# EAGLE design board (EAGLE 9.6.2)
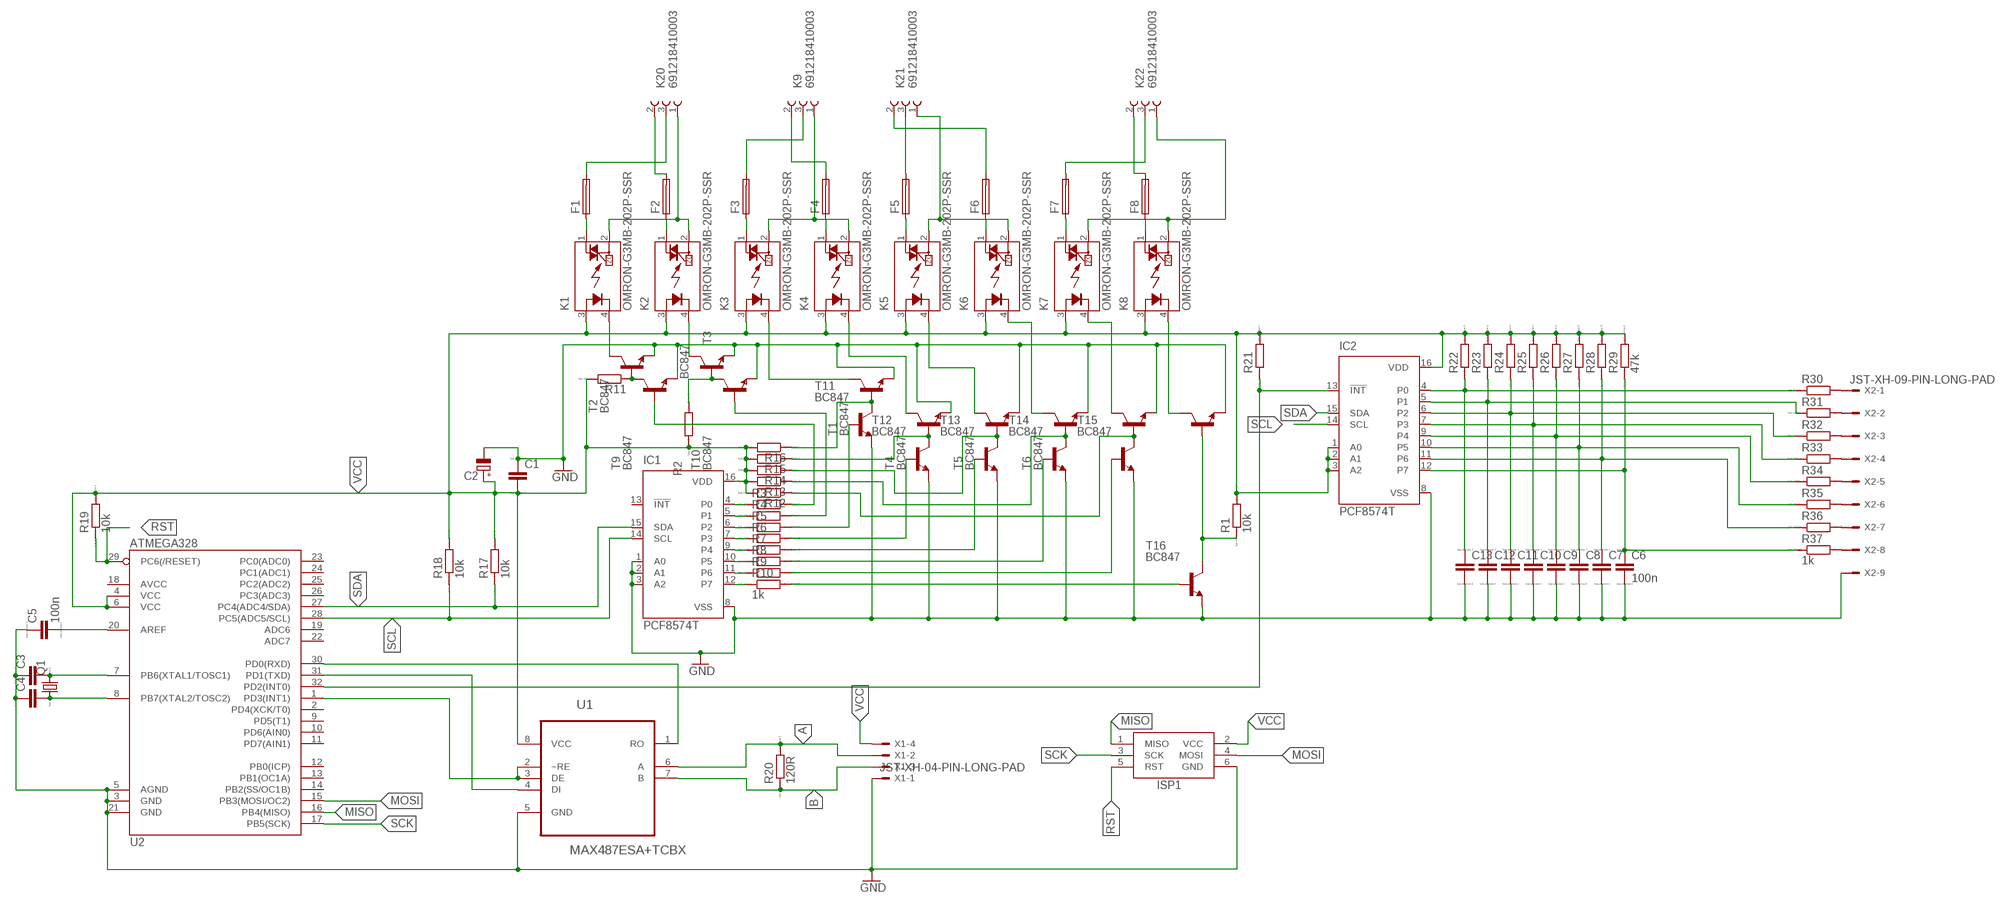
[diagram p0: schematic, sheet 1]

## Parts
C1  CC1206  [C1206]
C2  CPOL-EU150CLZ-0810  [150CLZ-0810]
C3  C  [C0805]
C4  C  [C0805]
C5  100n  C  [C0805]
C6  100n  C  [C0805]
C7  C  [C0805]
C8  C  [C0805]
C9  C  [C0805]
C10  C  [C0805]
C11  C  [C0805]
C12  C  [C0805]
C13  C  [C0805]
F1  FUSELITTLEFUSE  [LITTLEFUSE]
F2  FUSELITTLEFUSE  [LITTLEFUSE]
F3  FUSELITTLEFUSE  [LITTLEFUSE]
F4  FUSELITTLEFUSE  [LITTLEFUSE]
F5  FUSELITTLEFUSE  [LITTLEFUSE]
F6  FUSELITTLEFUSE  [LITTLEFUSE]
F7  FUSELITTLEFUSE  [LITTLEFUSE]
F8  FUSELITTLEFUSE  [LITTLEFUSE]
IC1  PCF8574T  [SO16W]
IC2  PCF8574T  [SO16W]
ISP1  AVRISP-6  [AVRISP]
K1  OMRON-G3MB-202P-SSR  [OMRON-G3MB-202P-SSR]
K2  OMRON-G3MB-202P-SSR  [OMRON-G3MB-202P-SSR]
K3  OMRON-G3MB-202P-SSR  [OMRON-G3MB-202P-SSR]
K4  OMRON-G3MB-202P-SSR  [OMRON-G3MB-202P-SSR]
K5  OMRON-G3MB-202P-SSR  [OMRON-G3MB-202P-SSR]
K6  OMRON-G3MB-202P-SSR  [OMRON-G3MB-202P-SSR]
K7  OMRON-G3MB-202P-SSR  [OMRON-G3MB-202P-SSR]
K8  OMRON-G3MB-202P-SSR  [OMRON-G3MB-202P-SSR]
K9  691218410003  [691218410003]
K20  691218410003  [691218410003]
K21  691218410003  [691218410003]
K22  691218410003  [691218410003]
Q1  CRYSTALHC49S  [HC49/S]
R1  10k  RR1206  [R1206]
R2  RR1206  [R1206]
R3  RR1206  [R1206]
R4  RR1206  [R1206]
R5  RR1206  [R1206]
R6  RR1206  [R1206]
R7  RR1206  [R1206]
R8  RR1206  [R1206]
R9  RR1206  [R1206]
R10  1k  RR1206  [R1206]
R11  RR1206  [R1206]
R12  RR1206  [R1206]
R13  RR1206  [R1206]
R14  RR1206  [R1206]
R15  RR1206  [R1206]
R16  RR1206  [R1206]
R17  10k  RR1206  [R1206]
R18  10k  RR1206  [R1206]
R19  10k  RR1206  [R1206]
R20  120R  RR1206  [R1206]
R21  RR1206  [R1206]
R22  RR1206  [R1206]
R23  RR1206  [R1206]
R24  RR1206  [R1206]
R25  RR1206  [R1206]
R26  RR1206  [R1206]
R27  RR1206  [R1206]
R28  RR1206  [R1206]
R29  47k  RR1206  [R1206]
R30  RR1206  [R1206]
R31  RR1206  [R1206]
R32  RR1206  [R1206]
R33  RR1206  [R1206]
R34  RR1206  [R1206]
R35  RR1206  [R1206]
R36  RR1206  [R1206]
R37  1k  RR1206  [R1206]
T1  BC847  [SOT23]
T2  BC847  [SOT23]
T3  BC847  [SOT23]
T4  BC847  [SOT23]
T5  BC847  [SOT23]
T6  BC847  [SOT23]
T7  BC847  [SOT23]
T8  BC847  [SOT23]
T9  BC847  [SOT23]
T10  BC847  [SOT23]
T11  BC847  [SOT23]
T12  BC847  [SOT23]
T13  BC847  [SOT23]
T14  BC847  [SOT23]
T15  BC847  [SOT23]
T16  BC847  [SOT23]
U1  MAX487ESA+TCBX  [SOIC127P600X175-8N]
U2  ATMEGA328  [TQFP32-08]
X1  JST-XH-04-PIN-LONG-PAD  [JST-XH-04-PACKAGE-LONG-PAD]
X2  JST-XH-09-PIN-LONG-PAD  [JST-XH-09-PACKAGE-LONG-PAD]

## Nets
A: R20.2 U1.6(A) X1.2
B: R20.1 U1.7(B) X1.3
GND: C1.1 C2.- C3.1 C4.1 C5.1 C6.2 C7.2 C8.2 C9.2 C10.2 C11.2 C12.2 C13.2 IC1.1(A0) IC1.2(A1) IC1.3(A2) IC1.8(VSS) IC2.8(VSS) ISP1.6(GND) T1.2(E) T2.2(E) T3.2(E) T4.2(E) T5.2(E) T6.2(E) T7.2(E) T8.2(E) T9.2(E) T10.2(E) T11.2(E) T12.2(E) T13.2(E) T14.2(E) T15.2(E) T16.2(E) U1.5(GND) U2.3(GND) U2.5(AGND) U2.21(GND) X1.1 X2.9
MISO: ISP1.1(MISO) U2.16(PB4(MISO))
MOSI: ISP1.4(MOSI) U2.15(PB3(MOSI/OC2))
N$1: C13.1 IC2.4(P0) R22.1 R30.1
N$3: IC1.4(P0) R3.1
N$4: IC1.5(P1) R4.1
N$5: R1.1 T8.1(B) T16.3(C)
N$6: IC1.6(P2) R5.1
N$7: IC1.7(P3) R6.1
N$8: IC1.9(P4) R7.1
N$9: IC1.10(P5) R8.1
N$10: IC1.11(P6) R9.1
N$11: IC1.12(P7) R10.1
N$12: U1.2(~RE) U1.3(DE) U2.1(PD3(INT1))
N$13: K7.4(K) T7.3(C)
N$14: C3.2 Q1.2 U2.7(PB6(XTAL1/TOSC1))
N$15: C12.1 IC2.5(P1) R23.1 R31.1
N$16: C11.1 IC2.6(P2) R24.1 R32.1
N$17: C4.2 Q1.1 U2.8(PB7(XTAL2/TOSC2))
N$18: R10.2 T16.1(B)
N$19: C10.1 IC2.7(P3) R25.1 R33.1
N$20: K1.2(DS2) K2.2(DS2) K20.1
N$21: C9.1 IC2.9(P4) R26.1 R34.1
N$22: C8.1 IC2.10(P5) R27.1 R35.1
N$23: C7.1 IC2.11(P6) R28.1 R36.1
N$24: C6.1 IC2.12(P7) R29.1 R37.1
N$25: R30.2 X2.1
N$26: IC2.13(!INT) R21.1 U2.32(PD2(INT0))
N$27: R31.2 X2.2
N$28: R32.2 X2.3
N$29: R33.2 X2.4
N$30: R34.2 X2.5
N$31: F1.1 K1.1(DS1)
N$32: F2.1 K2.1(DS1)
N$33: R35.2 X2.6
N$34: F3.1 K3.1(DS1)
N$35: F4.1 K4.1(DS1)
N$36: R36.2 X2.7
N$37: F5.1 K5.1(DS1)
N$38: K7.2(DS2) K8.2(DS2) K22.1
N$39: F8.2 K22.2
N$40: F7.2 K22.3
N$41: F6.2 K21.2
N$42: F5.2 K21.3
N$43: F4.2 K9.2
N$44: F3.2 K9.3
N$45: F6.1 K6.1(DS1)
N$46: F1.2 K20.3
N$47: F7.1 K7.1(DS1)
N$48: F8.1 K8.1(DS1)
N$49: R37.2 X2.8
N$50: F2.2 K20.2
N$51: R12.1 T7.1(B) T15.3(C)
N$52: R14.1 T5.1(B) T13.3(C)
N$53: C5.2 U2.20(AREF)
N$54: K3.2(DS2) K4.2(DS2) K9.1
N$55: K5.2(DS2) K6.2(DS2) K21.1
N$56: R13.1 T6.1(B) T14.3(C)
N$57: U1.1(RO) U2.30(PD0(RXD))
N$58: U1.4(DI) U2.31(PD1(TXD))
N$59: R11.1 T2.1(B) T9.3(C)
N$60: K1.4(K) T2.3(C)
N$61: R2.2 T3.1(B) T10.3(C)
N$62: K2.4(K) T3.3(C)
N$63: R3.2 T9.1(B)
N$64: R4.2 T10.1(B)
N$65: R16.1 T1.1(B) T11.3(C)
N$66: R15.1 T4.1(B) T12.3(C)
N$67: R5.2 T11.1(B)
N$68: R6.2 T12.1(B)
N$69: K8.4(K) T8.3(C)
N$70: R7.2 T13.1(B)
N$71: K6.4(K) T6.3(C)
N$72: K5.4(K) T5.3(C)
N$73: R8.2 T14.1(B)
N$74: K4.4(K) T4.3(C)
N$75: R9.2 T15.1(B)
N$76: K3.4(K) T1.3(C)
RST: ISP1.5(RST) R19.1 U2.29(PC6(/RESET))
SCK: ISP1.3(SCK) U2.17(PB5(SCK))
SCL: IC1.14(SCL) IC2.14(SCL) R18.1 U2.28(PC5(ADC5/SCL))
SDA: IC1.15(SDA) IC2.15(SDA) R17.1 U2.27(PC4(ADC4/SDA))
VCC: C1.2 C2.+ IC1.16(VDD) IC2.1(A0) IC2.2(A1) IC2.3(A2) IC2.16(VDD) ISP1.2(VCC) K1.3(A) K2.3(A) K3.3(A) K4.3(A) K5.3(A) K6.3(A) K7.3(A) K8.3(A) R1.2 R2.1 R11.2 R12.2 R13.2 R14.2 R15.2 R16.2 R17.2 R18.2 R19.2 R21.2 R22.2 R23.2 R24.2 R25.2 R26.2 R27.2 R28.2 R29.2 U1.8(VCC) U2.4(VCC) U2.6(VCC) X1.4
Unconnected: IC1.13(!INT) U2.2(PD4(XCK/T0)) U2.9(PD5(T1)) U2.10(PD6(AIN0)) U2.11(PD7(AIN1)) U2.12(PB0(ICP)) U2.13(PB1(OC1A)) U2.14(PB2(SS/OC1B)) U2.18(AVCC) U2.19(ADC6) U2.22(ADC7) U2.23(PC0(ADC0)) U2.24(PC1(ADC1)) U2.25(PC2(ADC2)) U2.26(PC3(ADC3))

## Library data of the parts
C1 C3-C13 = eagle-ltspice:C: CAPACITOR, European symbol; SPICEMODEL: NONE; SPICEPREFIX: C
C2 = rcl:CPOL-EU: POLARIZED CAPACITOR, European symbol; SPICEPREFIX: C
F1-F8 = fuse:FUSE: Fuse; OC_FARNELL: unknown; OC_NEWARK: unknown
IC1 IC2 = micro-philips:PCF8574: I2C-Bus Remote 8-bit I/O expander http://www.semiconductors.philips.com/acrobat_download/datasheets/PCF8574_4.pdf; MPN: PCF8574T/3,512; OC_FARNELL: 1201255; OC_NEWARK: 70R6870
ISP1 = adafruit:AVRISP: AVR ISP HEADER Standard 6 pin header for AVR programming
K1-K8 = Omron G3MB 202p SSR:OMRON-G3MB-202P-SSR: IT(rms) 8A, Zero Cross type SIP 4pin Triac output SSR Source: http://sharp-world.com/products/device/lineup/data/pdf/datasheet/s102s02_e.pdf
K9 K20-K22 = Wurth_Elektronik_Electromechanic_Terminal_Blocks_Connectors_rev15c:691218410003: WR-TBL Serie 2184 - 7.62mm Horizontal Entry Modular with Rising Cage Clamp - 5.3mm2 Wires, 3 Pins=>Code : Con_TBL_Screw_RisingClamp_7.62_691218410003 <http://katalog.we-online.de/media/images/eican/Con_TBL_Screw_RisingClamp_7.62_6912184100xx_pf2.jpg> Details see: http://katalog.we-online.de/en/em/691_218_410_0xx Created 2014-06-18, Karrer Zheng 2014 (C) Würth Elektronik
Q1 = crystal:CRYSTAL: CRYSTAL; OC_FARNELL: 1667008; OC_NEWARK: unknown
R1-R37 = eagle-ltspice:R: RESISTOR, European symbol; SPICEMODEL: NONE; SPICEPREFIX: R
T1-T8 = transistor:BC847: NPN TRANSISTOR
T9-T16 = nxp_60:BC847: 45 V, 100 mA NPN general-purpose transistors NPN general-purpose transistor AAL Eindhoven MK
U1 = MAX487ESA_TCBX:MAX487ESA+TCBX: Low-Power, Slew-Rate-Limited RS-485/RS-422 Transceivers Check prices <https://pricing.snapeda.com/parts/MAX487ESA%2BTCBX/Maxim%20Integrated/view-part?ref=eda>; AVAILABILITY: Warning; DESCRIPTION: 1/1 Transceiver Half RS422, RS485 8-SOIC; MF: Maxim Integrated; MP: MAX487ESA+TCBX; PACKAGE: SOIC-8 Maxim Integrated; PRICE: None; PURCHASE-URL: https://pricing.snapeda.com/search/part/MAX487ESA+TCBX/?ref=eda
U2 = thecustomgeek:ATMEGA328: ATmega328P-AU TQFP 32 pin
X1 = Rembrandt Electronics - JST XH Connectors v1-0:JST-XH-04-PIN: JST XH Connector 2 Pin Wire to board connector. Pitch: 2,54 mm, (0.100") Number of pins: 4 Created by Rembrandt Electronics www.rembrandtelectronics.com
X2 = Rembrandt Electronics - JST XH Connectors v1-0:JST-XH-09-PIN: JST XH Connector 2 Pin Wire to board connector. Pitch: 2,54 mm, (0.100") Number of pins: 9 Created by Rembrandt Electronics www.rembrandtelectronics.com

## Board
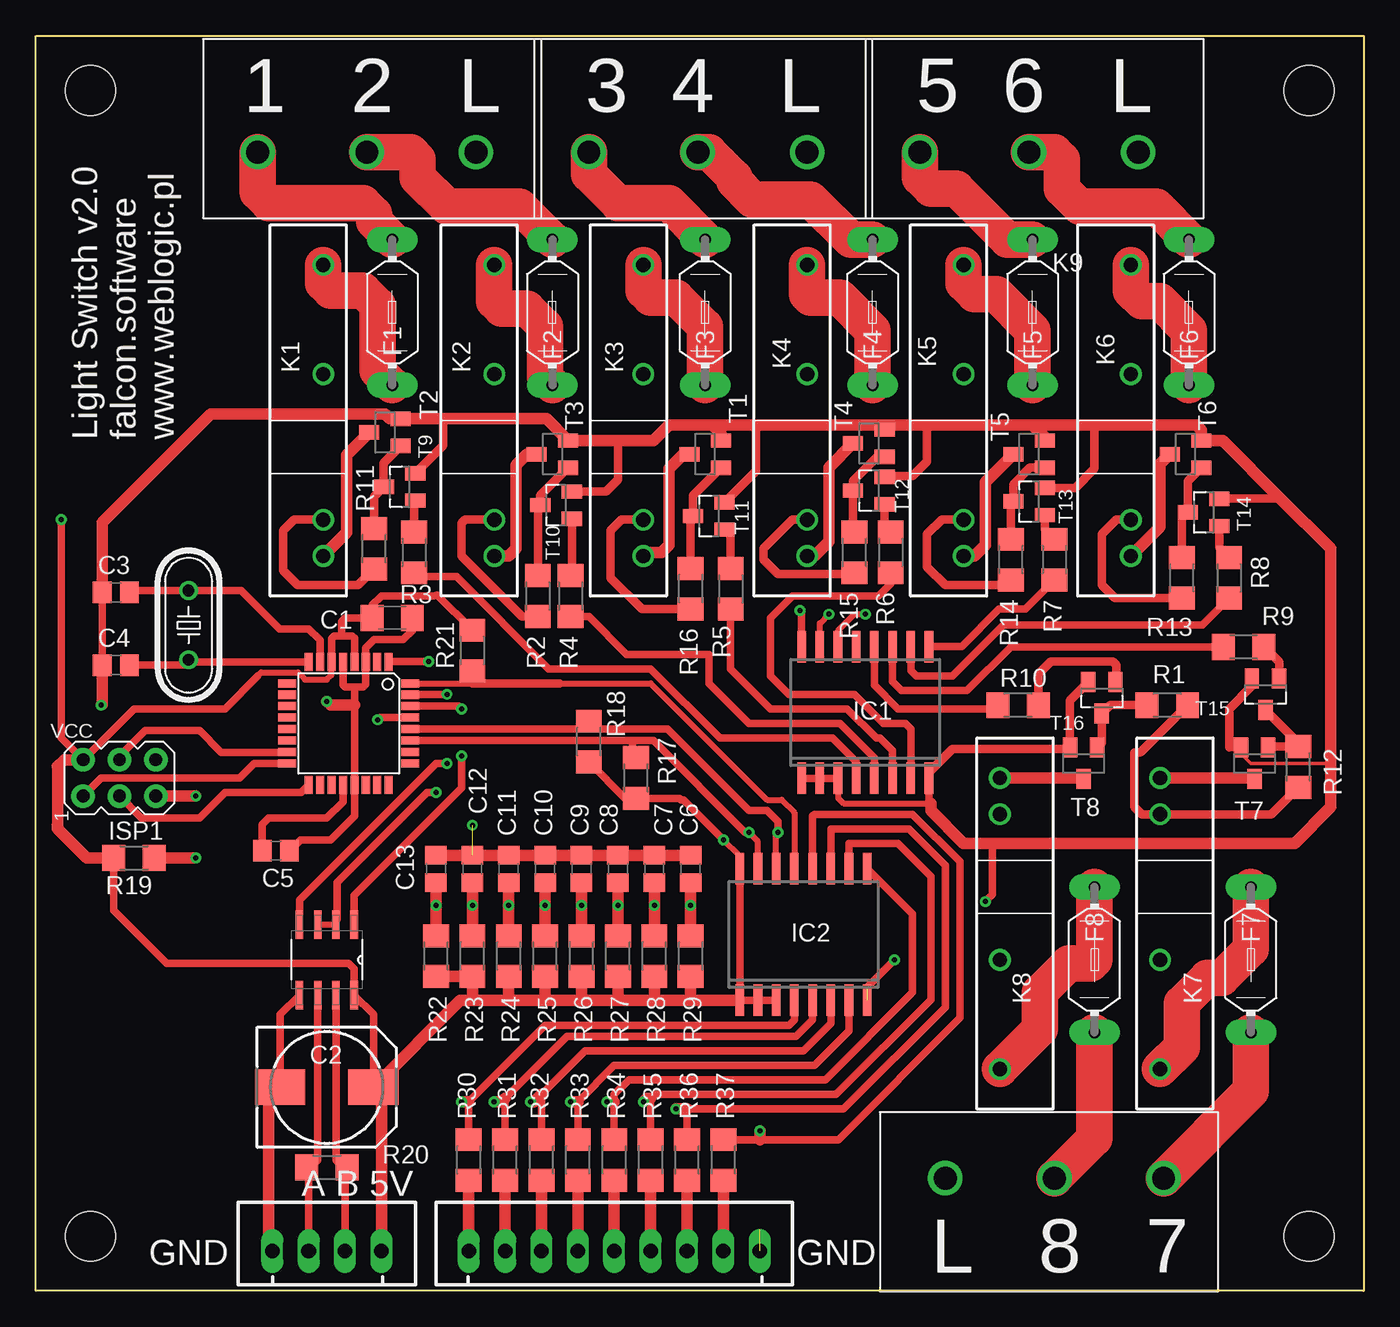
[diagram p1: board, top side]
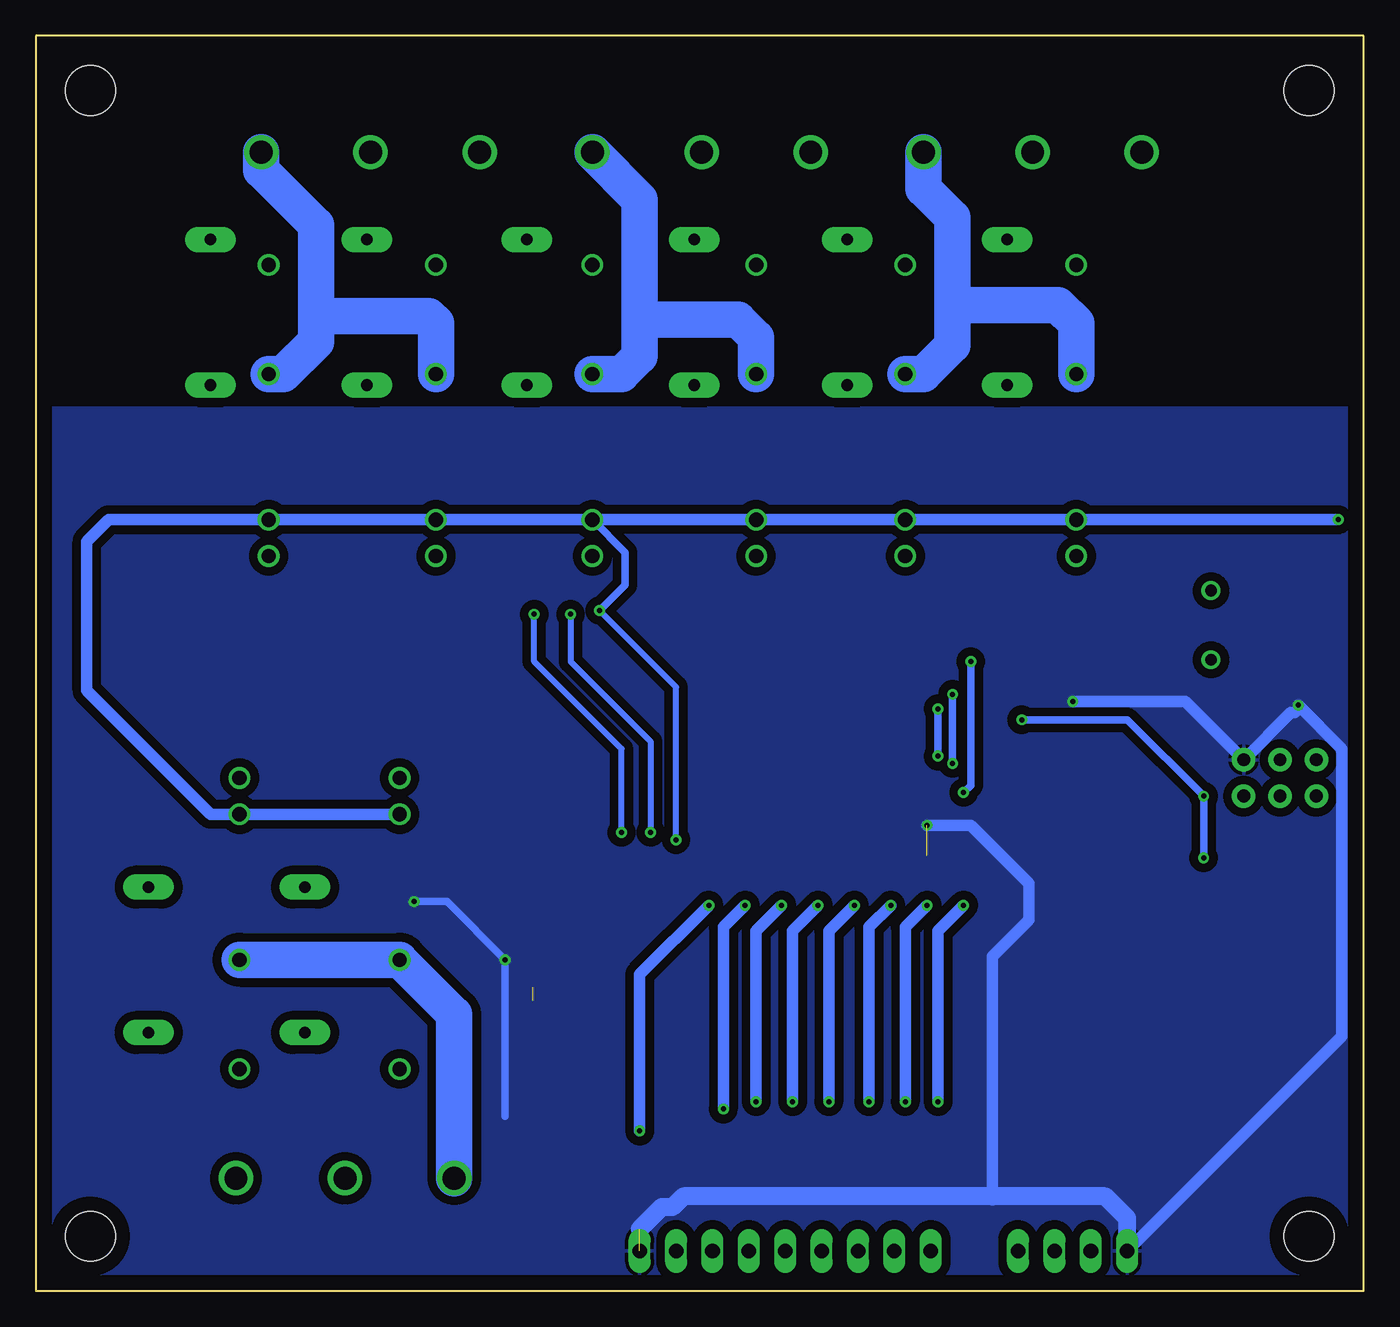
[diagram p2: board, bottom side, seen from below]

Size 92.71 x 87.63 mm. Coordinates in mm from the lower left corner, seen from the top.
Outline: 0,0 0,87.63 92.71,87.63 92.71,0 0,0
Copper layers (1*16): Top 0.035mm / dielectric 1.5mm / Bottom 0.035mm
Design rules "default": minimum track width 6mil, minimum drill 0.35mm, track to track 6mil, track to pad 6mil, pad to pad 6mil, via to via 6mil, smd to smd 6mil, copper to edge 40mil, drill to drill 6mil, minimum pad ring 10mil, minimum via ring 8mil, stop-mask expansion 4mil, vias tented up to drill 0mil, thermal gap 10mil
Holes 3.48 mm at 3.81,83.82 88.9,83.82 88.9,3.81 3.81,3.81

### Footprints (pad centres in the part's own frame; a part is rotated, then mirrored left to right if it is on the bottom)
C1206 = smd 1.6 x 1.8: 1 -1.4,0; 2 1.4,0
150CLZ-0810 = smd 3.5 x 2.5: + 3.25,0; - -3.25,0
C0805 = smd 1.3 x 1.5: 1 -0.95,0; 2 0.95,0
LITTLEFUSE = drill 0.813 pad 1.778 long: 1 -5.08,0; 2 5.08,0
SO16W = smd 0.6 x 2.2: 1 -4.445,-4.6; 2 -3.175,-4.6; 3 -1.905,-4.6; 4 -0.635,-4.6; 5 0.635,-4.6; 6 1.905,-4.6; 7 3.175,-4.6; 8 4.445,-4.6; 9 4.445,4.6; 10 3.175,4.6; 11 1.905,4.6; 12 0.635,4.6; 13 -0.635,4.6; 14 -1.905,4.6; 15 -3.175,4.6; 16 -4.445,4.6
AVRISP = drill 0.9 pad 1.626: 1 -1.27,2.54; 2 1.27,2.54; 3 -1.27,0; 4 1.27,0; 5 -1.27,-2.54; 6 1.27,-2.54
OMRON-G3MB-202P-SSR = drill 1: 1 -12.7,0; 2 -5.08,0; 3 5.08,0; 4 7.62,0
691218410003 = drill 1.6: 1 -7.62,0; 2 0,0; 3 7.62,0
HC49/S = drill 0.813: 1 -2.413,0; 2 2.413,0
R1206 = smd 1.6 x 1.803: 1 -1.422,0; 2 1.422,0
SOT23 = smd 1 x 1.4: 1 -0.95,-1.1; 2 0.95,-1.1; 3 0,1.1
SOIC127P600X175-8N = smd 1.981 x 0.533: 1 -2.464,1.905; 2 -2.464,0.635; 3 -2.464,-0.635; 4 -2.464,-1.905; 5 2.464,-1.905; 6 2.464,-0.635; 7 2.464,0.635; 8 2.464,1.905
TQFP32-08 = smd 1.27 x 0.559: 1 -4.293,2.8; 2 -4.293,2; 3 -4.293,1.2; 4 -4.293,0.4; 5 -4.293,-0.4; 6 -4.293,-1.2; 7 -4.293,-2; 8 -4.293,-2.8; 17 4.293,-2.8; 18 4.293,-2; 19 4.293,-1.2; 20 4.293,-0.4; 21 4.293,0.4; 22 4.293,1.2; 23 4.293,2; 24 4.293,2.8 | smd 0.559 x 1.27: 9 -2.8,-4.293; 10 -2,-4.293; 11 -1.2,-4.293; 12 -0.4,-4.293; 13 0.4,-4.293; 14 1.2,-4.293; 15 2,-4.293; 16 2.8,-4.293; 25 2.8,4.293; 26 2,4.293; 27 1.2,4.293; 28 0.4,4.293; 29 -0.4,4.293; 30 -1.2,4.293; 31 -2,4.293; 32 -2.8,4.293
JST-XH-04-PACKAGE-LONG-PAD = drill 1.016 long: 1 -3.81,0; 2 -1.27,0; 3 1.27,0; 4 3.81,0
JST-XH-09-PACKAGE-LONG-PAD = drill 1.016 long: 1 -10.16,0; 2 -7.62,0; 3 -5.08,0; 4 -2.54,0; 5 0,0; 6 2.54,0; 7 5.08,0; 8 7.62,0; 9 10.16,0

### Placement (x,y rotation side)
C1  24.89,46.99 180 top
C2  20.32,14.22 0 top
C3  5.59,48.77 0 top
C4  5.59,43.69 0 top
C5  16.76,30.73 180 top
C6  45.72,29.46 90 top
C7  43.18,29.46 90 top
C8  40.64,29.46 90 top
C9  38.1,29.46 90 top
C10  35.56,29.46 90 top
C11  33.02,29.46 90 top
C12  30.48,29.46 90 top
C13  27.94,29.46 90 top
F1  24.89,68.33 90 top
F2  36.07,68.33 90 top
F3  46.74,68.33 90 top
F4  58.42,68.33 90 top
F5  69.6,68.33 90 top
F6  80.52,68.33 90 top
F7  84.84,23.11 270 top
F8  73.91,23.11 270 top
IC1  57.91,40.39 0 top
IC2  53.59,24.89 0 top
ISP1  5.84,35.81 90 top
K1  20.07,58.93 270 top
K2  32,58.93 270 top
K3  42.42,58.93 270 top
K4  53.85,58.93 270 top
K5  64.77,58.93 270 top
K6  76.45,58.93 270 top
K7  78.49,28.19 90 top
K8  67.31,28.19 90 top
K9  46.23,79.5 180 top
K20  23.11,79.5 180 top
K21  69.34,79.5 180 top
K22  71.12,7.87 0 top
Q1  10.67,46.48 90 top
R1  78.99,40.89 0 top
R2  35.05,48.51 90 top
R3  26.42,51.56 90 top
R4  37.34,48.51 90 top
R5  48.51,49.02 90 top
R6  59.69,51.56 90 top
R7  71.12,51.05 90 top
R8  83.31,49.78 90 top
R9  84.33,44.96 0 top
R10  68.58,40.89 0 top
R11  23.62,51.82 270 top
R12  88.14,36.58 270 top
R13  80.01,49.78 270 top
R14  68.07,51.05 270 top
R15  57.15,51.56 270 top
R16  45.72,49.02 270 top
R17  41.91,35.81 270 top
R18  38.61,38.35 270 top
R19  6.86,30.23 180 top
R20  20.32,8.64 180 top
R21  30.48,44.7 90 top
R22  27.94,23.37 270 top
R23  30.48,23.37 270 top
R24  33.02,23.37 270 top
R25  35.56,23.37 270 top
R26  38.1,23.37 270 top
R27  40.64,23.37 270 top
R28  43.18,23.37 270 top
R29  45.72,23.37 270 top
R30  30.23,9.14 270 top
R31  32.77,9.14 270 top
R32  35.31,9.14 270 top
R33  37.85,9.14 270 top
R34  40.39,9.14 270 top
R35  42.93,9.14 270 top
R36  45.47,9.14 270 top
R37  48.01,9.14 270 top
T1  46.74,58.42 90 top
T2  24.38,59.94 90 top
T3  36.07,58.42 90 top
T4  58.17,59.18 90 top
T5  69.34,58.42 90 top
T6  80.26,58.42 90 top
T7  85.09,36.83 180 top
T8  73.15,36.83 180 top
T9  25.4,56.13 90 top
T10  36.32,54.86 90 top
T11  46.99,54.1 90 top
T12  58.17,55.88 90 top
T13  69.34,55.12 90 top
T14  81.53,54.36 90 top
T15  85.85,41.66 180 top
T16  74.42,41.4 180 top
U1  20.32,23.11 270 top
U2  21.84,39.62 270 top
X1  20.32,2.79 0 top
X2  40.39,2.79 0 top

### Tracks (layer width: path | path; a pad name or v marks a point on that pad's centre or on a via)
A
  Top 0.508: X1.2 19.05,8.48 | 19.05,8.48 R20.2 | U1.6 19.68,9.12 19.05,8.48
B
  Top 0.508: X1.3 21.59,8.48 | 21.59,8.48 R20.1 | U1.7 20.95,9.12 21.59,8.48
GND  (via drill 0.35)  (3 unrouted)
  Top 0.254: 90.42,36.83 84.84,36.83 84.14,37.53 T7.2
  Top 0.406: IC1.3 56.01,34.42 56.39,34.04 62.36,34.04
  Top 0.508: 62.48,33.53 62.36,33.66 62.36,34.04 IC1.8 | IC1.1 IC1.2 IC1.3 | 58.04,21.21 v59.94,23.11 | 66.8,31.24 66.8,27.69 v66.29,27.18 | C2.- 17.07,19.3 U1.5 | U2.5 21.44,42.31 21.59,42.16 22.1,42.16 | 22.1,42.16 22.86,42.16 23.04,42.35 U2.3 23.04,44.89 23.62,45.47 25.65,45.47 26.29,46.1 C1.1 | 22.1,42.16 22.24,42.02 22.24,40.89 U2.21 22.24,33.17 20.57,31.5 18.48,31.5 C5.1 | C3.1 4.64,48.51 C4.1 | T7.2 83.31,37.93
  Top 0.61: T9.2 28.45,59.03 28.45,60.89 | T10.2 39.81,55.81 40.64,56.64 40.64,59.37 | T11.2 50.29,57.25 50.29,60.45 | T12.2 59.33,56.9 61.21,56.9 62.23,57.91 62.23,60.45 | T13.2 72.58,56.07 73.91,57.4 73.91,60.45 | T14.2 86.8,55.31 86.87,55.37 | T15.2 84.9,42.23 83.31,40.64 83.31,37.93 | T16.2 72.2,41.23 T8.2 72.12,37.85 64.01,37.85 62.36,36.2 IC1.8
  Top 0.813: 47.24,60.45 44.2,60.45 43.11,59.37 40.64,59.37 T3.2 35.64,60.89 28.45,60.89 T2.2 24.7,60.89 24.38,61.21 12.19,61.21 4.64,53.66 4.64,48.51 | T1.2 47.84,59.86 47.24,60.45 | 47.24,60.45 50.29,60.45 58.67,60.45 | 58.67,60.45 58.99,60.13 T4.2 | 58.67,60.45 62.23,60.45 69.6,60.45 | T5.2 70.44,59.61 69.6,60.45 | 69.6,60.45 73.91,60.45 81.03,60.45 81.36,60.11 T6.2 82.87,59.37 86.87,55.37 90.42,51.82 90.42,36.83 90.42,33.78 87.88,31.24 66.8,31.24 64.77,31.24 62.48,33.53 62.48,34.04 | X1.1 16.26,3.05 16.26,13.41 C2.- | C4.1 4.64,40.96 v4.57,40.89 | 22.24,40.89 20.57,40.89 v20.32,41.15 | C6.2 C7.2 C8.2 C9.2 C10.2 C11.2 C12.2 C13.2
  Bottom 0.508: v66.29,27.18 64.01,27.18 v59.94,23.11 59.94,12.19
  Bottom 0.813: X1.1 1.52,17.78 1.52,37.85 v4.57,40.89 4.57,40.64 4.83,40.39 5.08,40.39 ISP1.6 12.45,41.15 v20.32,41.15 | 25.91,6.6 25.91,23.37 23.37,25.91 23.37,28.45 27.43,32.51 v30.48,32.51
  Bottom 1.27: X1.1 16.51,5.08 18.03,6.6 25.91,6.6 47.5,6.6 48.26,5.84 49.02,5.84 50.55,4.32
  pour Bottom (isolate 0.61): 1.02,61.72 92.2,61.72 92.2,1.52 91.69,1.02 1.02,1.02
MISO
  Top 0.508: ISP1.1 4.57,35.81 14.22,35.81 15.23,36.82 U2.16
MOSI
  Top 0.508: ISP1.4 5.84,37.34 7.62,39.12 11.43,39.12 12.95,37.59 17.52,37.59 U2.15
N$1  (via drill 0.35)
  Top 0.508: IC2.4 52.96,18.92 52.58,18.54 35.56,18.54 30.23,13.21 R30.1
  Top 0.813: 30.23,13.21 v29.72,13.21 | R22.1 v27.94,26.92 C13.1
  Bottom 0.813: v27.94,26.92 29.72,25.15 v29.72,13.21
N$3
  Top 0.508: IC1.4 57.28,36.96 55.63,38.61 47.75,38.61 42.93,43.43 35.81,43.43 29.36,49.89 26.67,49.89 R3.1
N$4
  Top 0.508: R4.1 38.61,47.09 41.25,44.45 46.99,44.45 46.99,42.42 49.78,39.62 56.13,39.62 58.55,37.21 IC1.5
N$5
  Top 0.61: T8.1 74.42,38.25 T16.3 75.01,40.89 R1.1
N$6
  Top 0.508: IC1.6 59.82,37.72 58.93,38.61 58.67,38.61 56.64,40.64 51.31,40.64 48.51,43.43 R5.1
N$7
  Top 0.508: IC1.7 61.09,39.24 60.71,39.62 59.18,39.62 57.15,41.66 52.58,41.66 51.31,42.93 51.31,46.99 52.83,48.51 58.83,48.51 59.69,49.38 R6.1
N$8
  Top 0.508: IC1.9 64.64,44.99 67.26,47.6 69.09,47.6 R7.1
N$9
  Top 0.508: IC1.10 61.09,43.31 61.47,42.93 64.01,42.93 67.56,46.48 81.43,46.48 R8.1
N$10
  Top 0.508: IC1.11 59.82,42.55 60.45,41.91 65.02,41.91 68.07,44.96 R9.1
N$11
  Top 0.508: IC1.12 58.55,42.29 60.2,40.64 66.9,40.64 R10.1
N$12  (via drill 0.35)
  Top 0.406: U1.3 U1.2
  Top 0.508: U1.2 20.95,25.83 21.04,25.92 21.04,28.52 27.33,34.8 v27.94,34.8 | U2.1 24.67,43.94 v27.43,43.94
  Bottom 0.508: v27.43,43.94 27.43,35.31 v27.94,34.8
N$13
  Top 0.813: K7.4 85.01,35.81 T7.3
N$14
  Top 0.508: U2.7 19.84,45.43 19.05,46.23 17.02,46.23 14.35,48.9 Q1.2 6.67,48.9 C3.2
N$15  (via drill 0.35)
  Top 0.508: IC2.5 54.23,18.92 53.09,17.78 37.08,17.78 32.77,13.46 R31.1
  Top 0.813: R23.1 v30.48,26.92 C12.1 | 32.77,13.46 32.51,13.21 v32,13.21
  Bottom 0.813: v30.48,26.92 32,25.4 v32,13.21
N$16  (via drill 0.35)
  Top 0.508: IC2.6 55.5,18.67 53.59,16.76 38.35,16.76 35.31,13.72 R32.1
  Top 0.813: R24.1 v33.02,26.92 C11.1 | 35.31,13.72 34.8,13.21 v34.54,13.21
  Bottom 0.813: v33.02,26.92 34.54,25.4 v34.54,13.21
N$17
  Top 0.508: U2.8 10.82,43.92 Q1.1 10.29,43.69 C4.2
N$18
  Top 0.61: R10.2 70,43.08 70.87,43.94 75.18,43.94 75.44,43.69 75.44,42.57 T16.1
N$19  (via drill 0.35)
  Top 0.508: IC2.7 56.77,18.16 54.36,15.75 40.39,15.75 37.85,13.21 R33.1
  Top 0.813: R25.1 v35.56,26.92 C10.1 | 37.85,13.21 v37.34,13.21
  Bottom 0.813: v35.56,26.92 37.34,25.15 v37.34,13.21
N$20
  Bottom 2.54: K20.1 30.73,76.96 28.7,74.93 28.7,68.83 | K2.2 30.73,64.01 28.7,66.04 28.7,68.83 | K1.2 20.07,67.56 21.34,68.83 28.7,68.83
N$21  (via drill 0.35)
  Top 0.508: IC2.9 61.21,26.32 61.21,20.83 55.12,14.73 41.4,14.73 40.39,13.72 40.39,13.21 R34.1
  Top 0.813: R26.1 v38.1,26.92 C9.1 | 40.39,13.21 v39.88,13.21
  Bottom 0.813: v38.1,26.92 39.88,25.15 v39.88,13.21
N$22  (via drill 0.35)
  Top 0.508: IC2.10 56.77,31.24 60.2,31.24 62.48,28.96 62.48,20.32 55.88,13.72 43.18,13.72 42.93,13.46 R35.1
  Top 0.813: R27.1 v40.64,26.92 C8.1 | 42.93,13.46 42.67,13.46 v42.42,13.21
  Bottom 0.813: v40.64,26.92 42.42,25.15 v42.42,13.21
N$23  (via drill 0.35)
  Top 0.508: IC2.11 55.5,32.26 60.96,32.26 63.5,29.72 63.5,19.81 56.39,12.7 45.47,12.7 R36.1
  Top 0.813: R28.1 v43.18,26.92 C7.1 | 45.47,12.7 v44.7,12.7
  Bottom 0.813: v43.18,26.92 44.7,25.4 v44.7,12.7
N$24  (via drill 0.35)
  Top 0.508: IC2.12 54.23,33.15 54.36,33.27 61.21,33.27 64.52,29.97 64.52,19.05 56.03,10.57 50.55,10.57 R37.1
  Top 0.813: R29.1 v45.72,26.92 C6.1 | 50.55,10.57 v50.55,11.18
  Bottom 0.813: v45.72,26.92 50.55,22.1 v50.55,11.18
N$25
  Top 0.813: R30.2 X2.1
N$26
  Top 0.406: U2.32 30.48,42.42 | 36.32,42.42 36.58,42.42 42.92,42.42 51.05,34.29 52.07,34.29 52.96,33.4 IC2.13
  Top 0.508: R21.1 30.48,42.42
  Top 0.61: 36.58,42.42 30.48,42.42
N$27
  Top 0.813: R31.2 X2.2
N$28
  Top 0.813: R32.2 X2.3
N$29
  Top 0.813: R33.2 X2.4
N$30
  Top 0.813: R34.2 X2.5
N$31
  Top 2.54: F1.1 23.88,64.26 23.88,68.83 22.86,69.85 20.57,69.85 20.07,70.36 K1.1
N$32
  Top 2.54: F2.1 35.56,63.75 35.56,67.31 34.29,68.58 32.51,68.58 32,69.09 K2.1
N$33
  Top 0.813: R35.2 X2.6
N$34
  Top 2.54: F3.1 46.74,67.31 44.7,69.34 42.93,69.34 42.42,69.85 K3.1
N$35
  Top 2.54: F4.1 58.42,67.06 56.13,69.34 54.1,69.34 53.85,69.6 K4.1
N$36
  Top 0.813: R36.2 X2.7
N$37
  Top 2.54: F5.1 69.6,67.06 67.06,69.6 65.53,69.6 64.77,70.36 K5.1
N$38
  Bottom 2.54: K7.2 K8.2 63.5,19.3 K22.1
N$39
  Top 2.54: K22.2 73.91,10.67 F8.2
N$40
  Top 2.54: K22.3 84.84,13.97 F7.2
N$41
  Top 2.54: F6.2 78.23,75.69 72.9,75.69 71.63,76.96 71.63,78.99 71.12,79.5 K21.2
N$42
  Top 2.54: F5.2 67.82,73.41 64.26,76.96 62.48,76.96 61.72,77.72 K21.3
N$43
  Top 2.54: F4.2 56.9,73.41 54.1,76.2 50.04,76.2 48.77,77.47 48.77,77.72 46.99,79.5 K9.2
N$44
  Top 2.54: F3.2 44.2,75.95 40.64,75.95 38.61,77.98 K9.3
N$45
  Top 2.54: F6.1 80.52,67.06 78.49,69.09 77.22,69.09 76.45,69.85 K6.1
N$46
  Top 2.54: F1.2 23.62,74.68 23.62,75.18 22.86,75.95 16.26,75.95 15.49,76.71 K20.3
N$47
  Top 2.54: K7.1 80.01,17.02 80.01,20.07 81.79,21.84 82.8,21.84 84.84,23.88 F7.1
N$48
  Top 2.54: K8.1 70.1,18.29 70.1,20.83 72.14,22.86 73.66,22.86 73.91,23.11 F8.1
N$49
  Top 0.813: R37.2 X2.8
N$50
  Top 2.54: F2.2 33.78,75.69 28.7,75.69 26.67,77.72 26.67,78.99 26.16,79.5 K20.2
N$51
  Top 0.61: T15.3 88.14,38.27 R12.1 86.11,38 T7.1
N$52
  Top 0.61: R14.1 68.07,54.95 T13.3 68.24,56.3 69.41,57.47 T5.1
N$53
  Top 0.508: U2.20 21.44,34.14 20.32,33.02 16.26,33.02 15.81,32.58 C5.2
N$54
  Bottom 2.54: K9.1 50.55,76.2 50.55,67.82 | 50.55,67.82 50.55,65.28 51.82,64.01 K4.2 | K3.2 42.42,66.55 43.69,67.82 50.55,67.82
N$55
  Bottom 2.54: K21.1 76.96,78.23 73.15,74.42 73.15,68.07 | K6.2 75.44,64.01 73.15,66.29 73.15,68.07 | K5.2 64.77,67.56 65.28,68.07 73.15,68.07
N$56
  Top 0.61: R13.1 80.01,53.93 T14.3 80.43,56.54 T6.1
N$57  (via drill 0.35)
  Top 0.508: U1.1 22.23,27.61 29.72,35.1 v29.72,37.34 | U2.30 29.53,40.82 v29.72,40.64
  Bottom 0.508: v29.72,40.64 v29.72,37.34
N$58  (via drill 0.35)
  Top 0.508: U2.31 28.67,41.62 v28.7,41.66 | U1.4 18.41,27.3 27.94,36.83 v28.7,36.83
  Bottom 0.508: v28.7,41.66 v28.7,36.83
N$59
  Top 0.61: R11.1 23.62,55.46 T9.3 24.3,57.81 T2.1
N$60
  Top 0.813: K1.4 21.71,52.95 21.71,58.37 T2.3
N$61
  Top 0.61: R2.2 35.05,54.69 T10.3 35.22,55.52 T3.1
N$62
  Top 0.813: K2.4 33.02,51.31 33.53,51.82 33.53,57.66 34.29,58.42 T3.3
N$63
  Top 0.61: R3.2 26.42,55.1 T9.1
N$64
  Top 0.61: T10.1 37.42,50.02 R4.2
N$65
  Top 0.61: R16.1 45.72,53.93 T11.3 45.89,55.52 T1.1
N$66
  Top 0.61: R15.1 57.07,53.07 T12.3 57.07,56.56 58.74,58.23 T4.1
N$67
  Top 0.61: R5.2 48.51,52.73 T11.1
N$68
  Top 0.61: R6.2 59.27,53.41 T12.1
N$69
  Top 0.813: K8.4 73.07,35.81 T8.3
N$70
  Top 0.61: R7.2 70.44,53.15 T13.1
N$71
  Top 0.813: K6.4 78.49,53.34 78.49,57.74 T6.3
N$72
  Top 0.813: K5.4 65.53,51.31 66.29,52.07 66.29,56.47 T5.3
N$73
  Top 0.61: R8.2 82.63,51.88 T14.1
N$74
  Top 0.813: K4.4 54.36,51.31 55.37,52.32 55.37,57.49 T4.3
N$75
  Top 0.61: T15.1 86.8,43.91 R9.2
N$76
  Top 0.813: K3.4 42.67,51.56 43.69,51.56 44.2,52.07 44.2,57.4 45.21,58.42 T1.3
RST  (via drill 0.35)
  Top 0.508: U2.29 24.02,40.02 v23.88,39.88
  Top 0.813: ISP1.5 v11.18,34.54 | R19.1 v11.18,30.23
  Bottom 0.508: v11.18,30.23 v11.18,34.54 16.51,39.88 v23.88,39.88
SCK
  Top 0.508: ISP1.3 7.37,33.02 11.43,33.02 13.21,34.8 18.51,34.8 U2.17
SCL  (via drill 0.35)
  Top 0.406: IC2.14 51.69,31.88 v51.82,32 | IC1.14 56.01,46.1 57.15,47.24 v57.91,47.24
  Top 0.508: U2.28 38.61,39.22 | 38.61,39.22 44.09,39.22 49.78,33.53 51.05,33.53 51.82,32.77 v51.82,32 | R18.1 38.61,39.22
  Bottom 0.406: v51.82,32 51.82,37.85 57.91,43.94 v57.91,47.24
SDA  (via drill 0.35)
  Top 0.406: IC2.15 50.42,31.37 v49.78,32 | IC1.15 54.74,46.61 v55.37,47.24
  Top 0.508: U2.27 41.66,38.42 | 41.66,38.42 43.11,38.42 49.53,32 v49.78,32 | R17.1 41.66,37.49 41.66,38.42
  Bottom 0.406: v55.37,47.24 55.37,43.94 49.78,38.35 v49.78,32
VCC  (via drill 0.35)
  Top 0.406: 15.49,42.93 15.75,43.18 18.29,43.18 18.8,42.67 20.32,42.67 20.64,43 U2.6 | IC2.16 49.15,30.35 v48.01,31.5
  Top 0.508: v53.34,47.5 53.47,47.37 IC1.16 | IC2.3 IC2.2 IC2.1 IC2.16 | C2.+ 23.57,19.3 U1.8 22.23,22.48 21.84,22.86 9.14,22.86 5.44,26.57 R19.2 | U2.6 20.64,45.54 20.83,45.72 21.34,45.72 | 21.34,45.72 22.1,45.72 22.24,45.57 U2.4 | 21.34,45.72 21.34,46.74 21.59,46.99 C1.2 23.49,47.88 24.13,48.51 27.79,48.51 28.01,48.6 R21.2 | 15.49,42.93 13.21,40.64 6.86,40.64 ISP1.2 1.78,38.61 v1.78,53.85 | R18.2 41.15,34.39 R17.2 44.96,34.39 45.06,34.29 45.21,34.29 v48.01,31.5
  Top 0.61: R11.2 22.5,49.28 18.29,49.28 17.27,50.29 17.27,53.09 18.03,53.85 K1.3 | R2.1 33.93,47.09 29.72,51.31 29.72,53.59 29.97,53.85 K2.3 | R16.2 42.32,47.6 40.13,49.78 40.13,53.09 40.89,53.85 K3.3 | R15.2 57.05,50.04 51.82,50.04 50.8,51.05 50.8,51.82 52.83,53.85 K4.3 | R14.2 67.72,49.28 63.5,49.28 62.23,50.55 62.23,52.83 63.25,53.85 K5.3 | R13.2 75.34,48.36 74.42,49.28 74.42,52.83 75.44,53.85 K6.3 | R12.2 86.26,33.27 K7.3 77.22,33.27 76.71,33.78 76.71,37.59 77.11,37.59 R1.2
  Top 0.813: X1.4 24.13,13.66 C2.+ 29.64,20.29 30.48,20.29 | R19.2 3.56,30.23 1.5,32.28 1.5,32.49 1.52,32.51 1.52,36.58 1.5,36.6 1.98,37.08 ISP1.2 | 30.48,20.29 33.02,20.29 | 33.02,20.29 35.56,20.29 | 35.56,20.29 38.1,20.29 | 38.1,20.29 40.64,20.29 | 40.64,20.29 43.18,20.29 | 43.18,20.29 45.72,20.29 | 45.72,20.29 IC2.1 | R29.2 45.72,20.29 | R28.2 43.18,20.29 | R27.2 40.64,20.29 | R26.2 38.1,20.29 | R25.2 35.56,20.29 | R24.2 33.02,20.29 | 30.48,20.29 R23.2 R22.2
  Bottom 0.406: v48.01,31.5 48.01,42.16 v53.34,47.5
  Bottom 0.508: K4.3 51.56,51.56 51.56,49.28 v53.34,47.5
  Bottom 0.813: K8.3 K7.3 80.52,33.27 89.15,41.91 89.15,52.32 87.63,53.85 K6.3 K5.3 K4.3 K3.3 K2.3 K1.3 v1.78,53.85

### Text on the board
tNames: 1 2 L | 3 4 L | 5 6 L | Light Switch v2.0 / falcon.software / www.weblogic.pl | VCC | A B 5V | GND | GND | L 8 7